# EAGLE design mega8 Control Board (EAGLE 5.07)
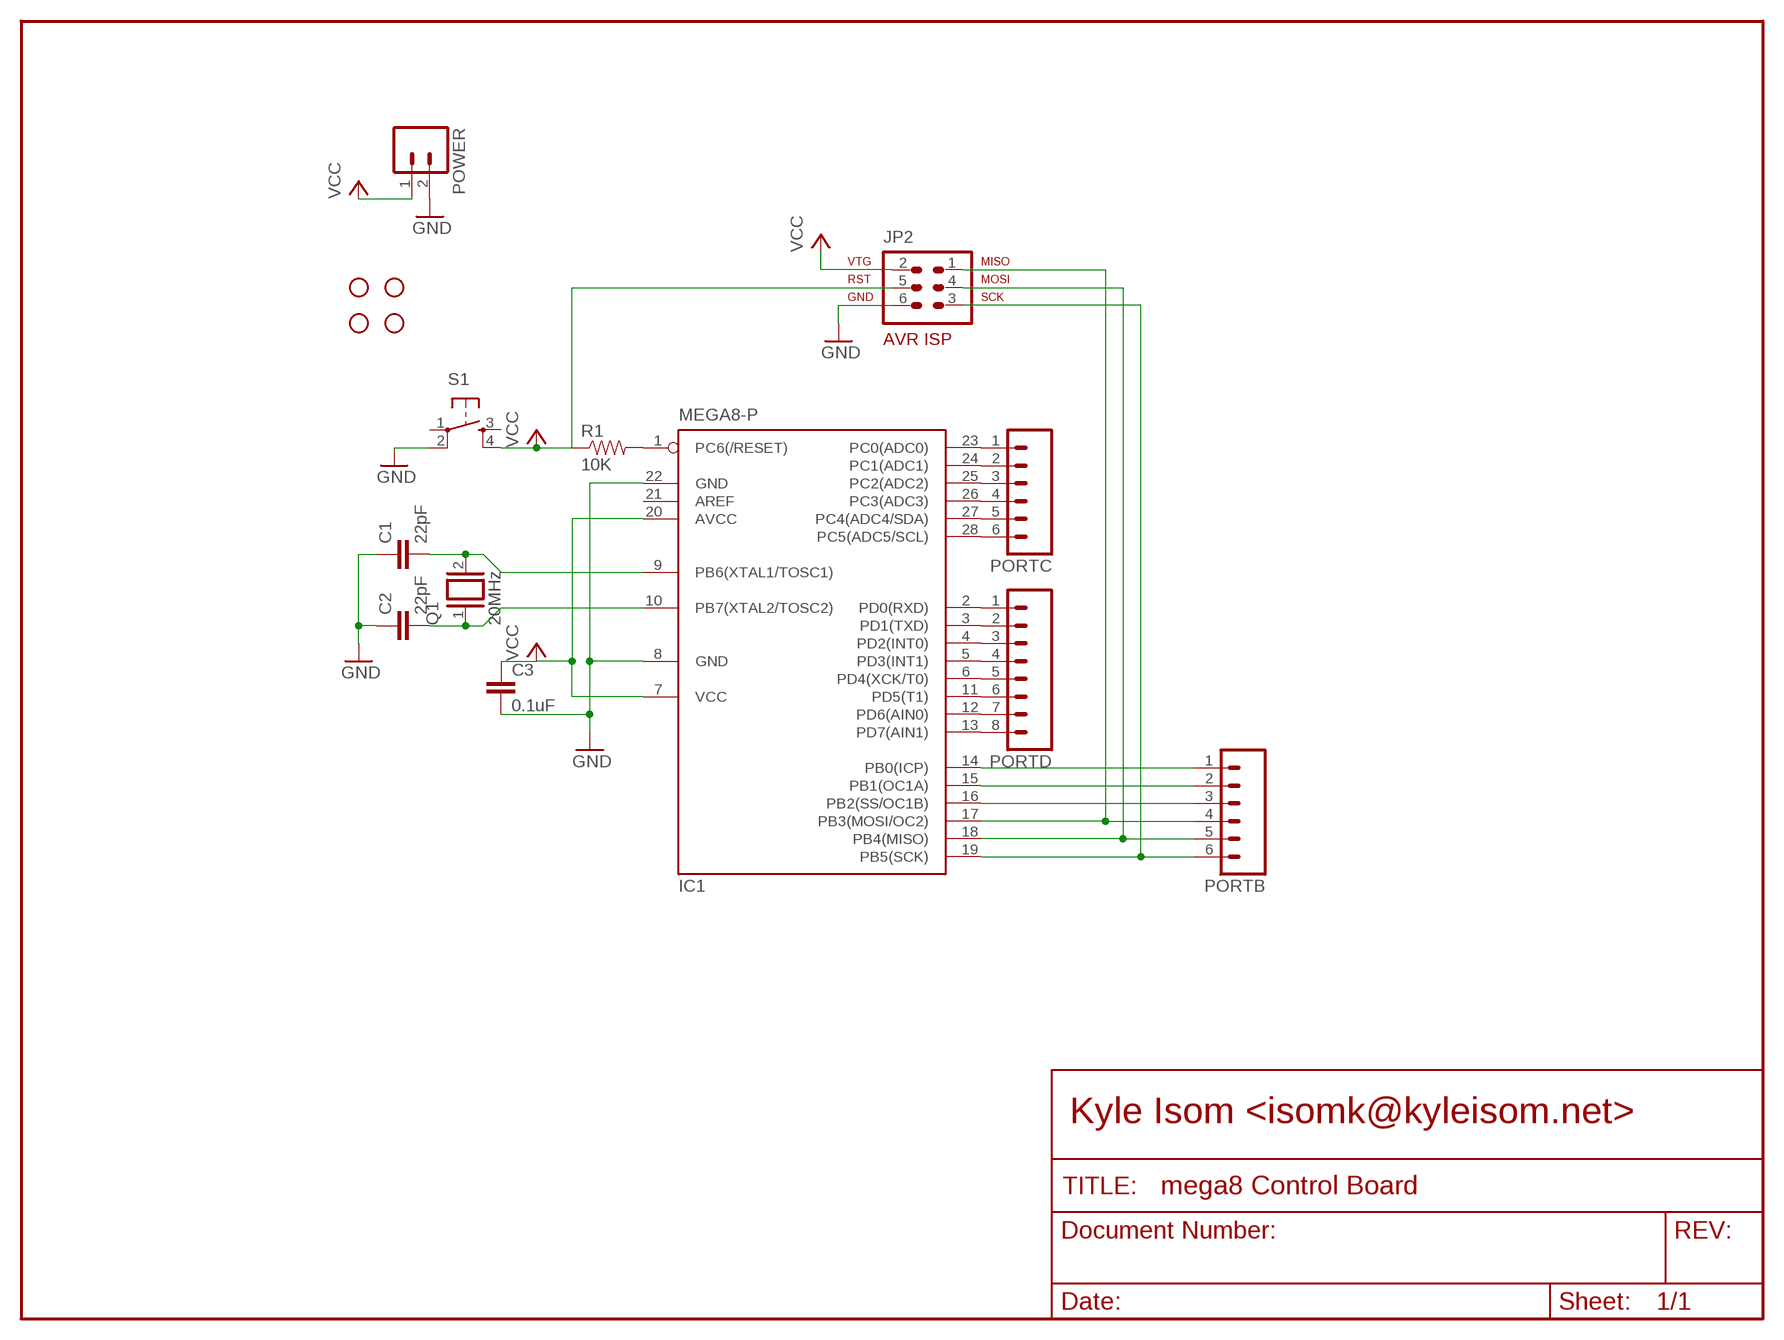
[diagram p0: schematic, sheet 1]

## Parts
C1  22pF  CAPPTH1  [CAP-PTH-5MM]
C2  22pF  CAPPTH1  [CAP-PTH-5MM]
C3  0.1uF  CAPPTH1  [CAP-PTH-5MM]
IC1  MEGA8-P  [DIL28-3]
JP1  STAND-OFF  [STAND-OFF]
JP2  AVR-ISP-6  [AVR-ISP-6]
JP3  STAND-OFF  [STAND-OFF]
JP4  STAND-OFF  [STAND-OFF]
JP5  STAND-OFF  [STAND-OFF]
PORTB  M06LOCK  [1X06_LOCK]
PORTC  M06LOCK  [1X06_LOCK]
PORTD  M08LOCK  [1X08_LOCK]
POWER  M02LOCK  [1X02_LOCK]
Q1  20MHz  XTAL/S  [QS]
R1  10K  RESISTORPTH1  [AXIAL-0.3]
S1  TAC_SWITCHPTH  [TACTILE-PTH]

## Nets
GND: C1.1 C2.1 C3.2 IC1.8(GND) IC1.22(GND) JP2.6 POWER.2 S1.2
N$1: IC1.1(PC6(/RESET)) R1.P$2
N$3: C1.2 IC1.9(PB6(XTAL1/TOSC1)) Q1.2
N$4: C2.2 IC1.10(PB7(XTAL2/TOSC2)) Q1.1
N$6: IC1.19(PB5(SCK)) JP2.3 PORTB.6
N$7: IC1.18(PB4(MISO)) JP2.4 PORTB.5
N$8: IC1.17(PB3(MOSI/OC2)) JP2.1 PORTB.4
N$9: IC1.23(PC0(ADC0)) PORTC.1
N$10: IC1.24(PC1(ADC1)) PORTC.2
N$11: IC1.25(PC2(ADC2)) PORTC.3
N$12: IC1.26(PC3(ADC3)) PORTC.4
N$13: IC1.27(PC4(ADC4/SDA)) PORTC.5
N$14: IC1.28(PC5(ADC5/SCL)) PORTC.6
N$15: IC1.2(PD0(RXD)) PORTD.1
N$16: IC1.3(PD1(TXD)) PORTD.2
N$17: IC1.4(PD2(INT0)) PORTD.3
N$18: IC1.5(PD3(INT1)) PORTD.4
N$19: IC1.6(PD4(XCK/T0)) PORTD.5
N$20: IC1.11(PD5(T1)) PORTD.6
N$21: IC1.12(PD6(AIN0)) PORTD.7
N$22: IC1.13(PD7(AIN1)) PORTD.8
N$23: IC1.14(PB0(ICP)) PORTB.1
N$24: IC1.15(PB1(OC1A)) PORTB.2
N$25: IC1.16(PB2(SS/OC1B)) PORTB.3
VCC: C3.1 IC1.7(VCC) IC1.20(AVCC) JP2.2 JP2.5 POWER.1 R1.P$1 S1.4
Unconnected: IC1.21(AREF) S1.1 S1.3

## Notes on the sheet
- Kyle Isom <isomk@kyleisom.net>

## Library data of the parts
C1-C3 = SparkFun:CAP: Capacitor Standard 0603 ceramic capacitor, and 0.1" leaded capacitor.
IC1 = atmel:MEGA8-P: MICROCONTROLLER 8 Kbytes FLASH, 1 kbytes SRAM, 512 bytes EEPROM, USART, 4-channel 10 bit ADC, 2-channel 8 bit ADC Pin compatible with Atmega48, ATMega88, ATMega168 Source: avr.lbr
JP1 JP3-JP5 = SparkFun:STAND-OFF: Stand Off This is the mechanical footprint for a #4 phillips button head screw. Use the keepout ring to avoid running the screw head into surrounding components. SKU : PRT-00447
JP2 = avr-6:AVR-ISP-6: AVR ISP-6 Serial Programming Header
PORTB PORTC = SparkFun:M06: Header 6 Standard 6-pin 0.1" header. Use with straight break away headers (SKU : PRT-00116), right angle break away headers (PRT-00553), swiss pins (PRT-00743), machine pins (PRT-00117), and female headers (PRT-00115). Molex polarized connector foot print use with SKU : PRT-08094 with associated crimp pins and housings. NOTES ON THE VARIANTS LOCK and LOCK_LONGPADS... This footprint was designed to help hold the alignment of a through-hole component (i.e. 6-pin header) while soldering it into place. You may notice that each hole has been shifted either up or down by 0.005 of an inch from it's more standard position (which is a perfectly straight line). This slight alteration caused the pins (the squares in the middle) to touch the edges of the holes. Because they are alternating, it causes a "brace" to hold the component in place. 0.005 has proven to be the perfect amount of "off-center" position when using our standard breakaway headers. Although looks a little odd when you look at the bare footprint, once you have a header in there, the alteration is very hard to notice. Also, if you push a header all the way into place, it is covered up entirely on the bottom side. This idea of altering the position of holes to aid alignment will be further integrated into the Sparkfun Library for other footprints. It can help hold any component with 3 or more connection pins.
PORTD = SparkFun:M08: Header 8 Standard 8-pin 0.1" header. Use with straight break away headers (SKU : PRT-00116), right angle break away headers (PRT-00553), swiss pins (PRT-00743), machine pins (PRT-00117), and female headers (PRT-00115).
POWER = SparkFun:M02: Header 2 Standard 2-pin 0.1" header. Use with straight break away headers (SKU : PRT-00116), right angle break away headers (PRT-00553), swiss pins (PRT-00743), machine pins (PRT-00117), and female headers (PRT-00115). Molex polarized connector foot print use with SKU : PRT-08233 with associated crimp pins and housings.
Q1 = special:XTAL/S: CRYSTAL
R1 = SparkFun:RESISTOR: Resistor Basic schematic elements and footprints for 0603, 1206, and PTH 1/10th watt (small) resistors.
S1 = SparkFun:TAC_SWITCH: Momentary Switch Button commonly used for reset or general input. Spark Fun Electronics SKU : COM-00097

## Board
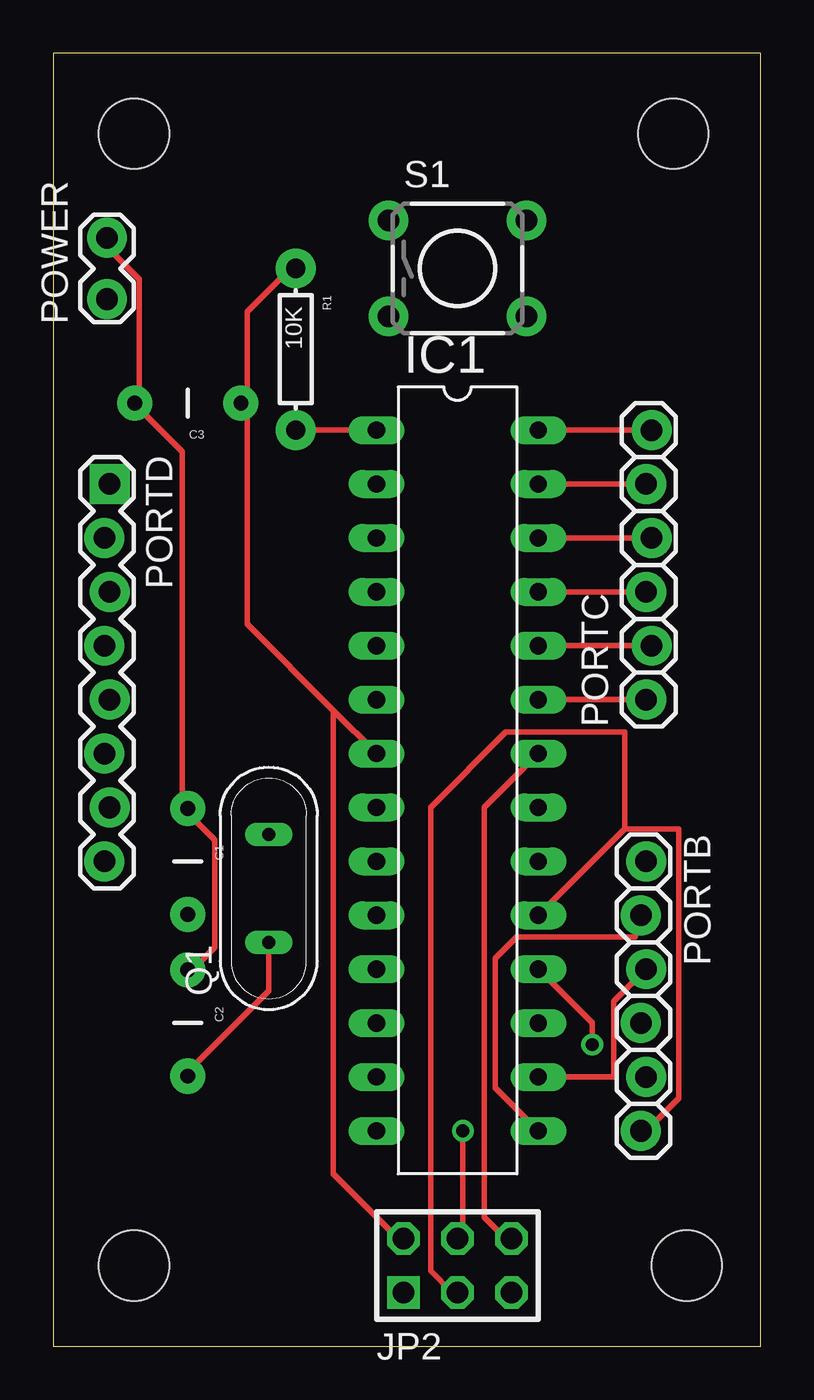
[diagram p1: board, top side]
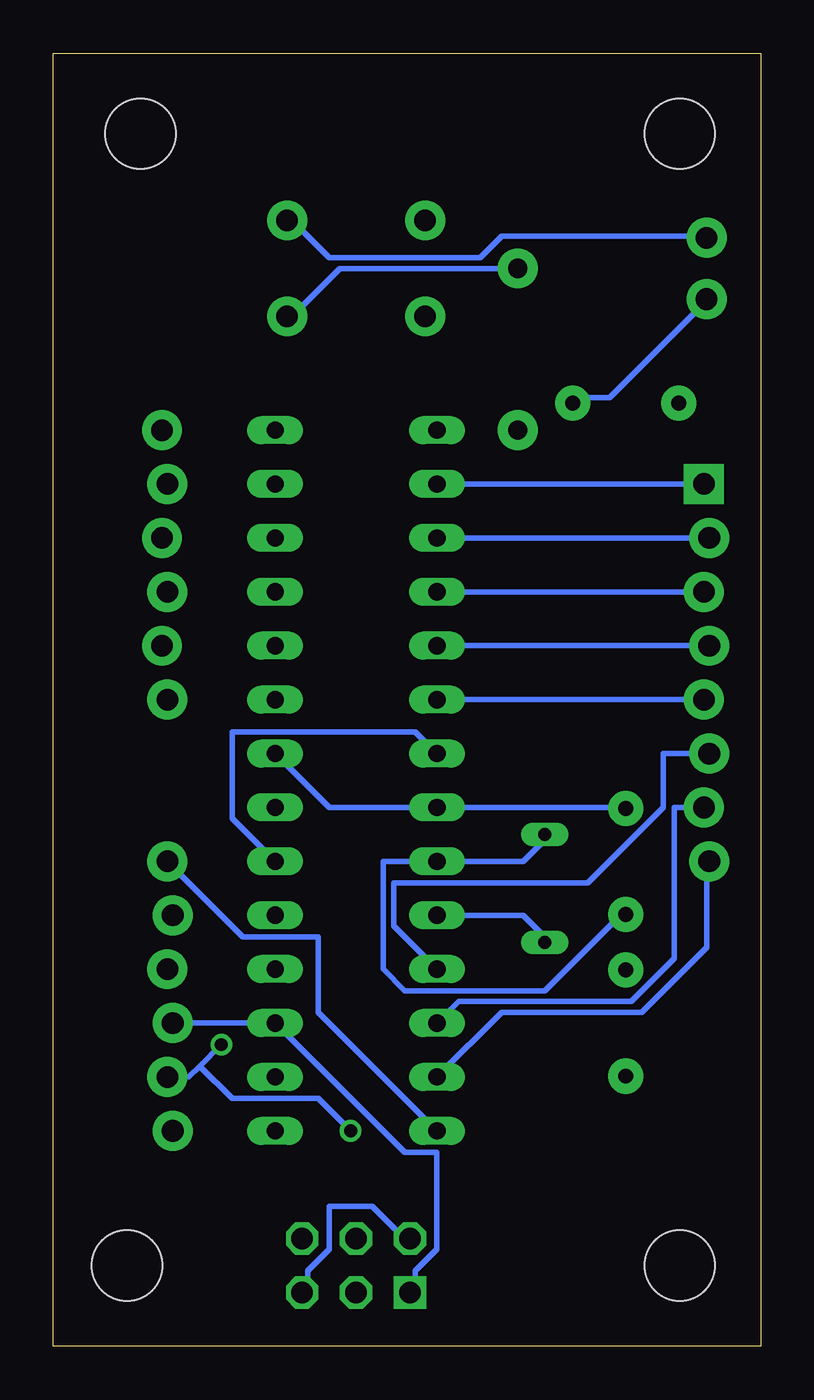
[diagram p2: board, bottom side, seen from below]

Size 33.33 x 60.95 mm. Coordinates in mm from the lower left corner, seen from the top.
Outline: 0,0 33.33,0 33.33,60.95 0,60.95 0,0
Copper layers (1*16): Top 0.035mm / dielectric 1.5mm / Bottom 0.035mm
Design rules "default": minimum track width 10mil, minimum drill 24mil, track to track 8mil, track to pad 8mil, pad to pad 8mil, via to via 8mil, smd to smd 8mil, copper to edge 40mil, drill to drill 8mil, minimum pad ring 10mil, minimum via ring 8mil, stop-mask expansion 4mil, vias tented up to drill 0mil, thermal gap 10mil

### Footprints (pad centres in the part's own frame; a part is rotated, then mirrored left to right if it is on the bottom)
CAP-PTH-5MM = drill 0.7 pad 1.651 round: 1 -2.5,0; 2 2.5,0
DIL28-3 = drill 0.813 long: 1 -16.51,-3.81; 2 -13.97,-3.81; 3 -11.43,-3.81; 4 -8.89,-3.81; 5 -6.35,-3.81; 6 -3.81,-3.81; 7 -1.27,-3.81; 8 1.27,-3.81; 9 3.81,-3.81; 10 6.35,-3.81; 11 8.89,-3.81; 12 11.43,-3.81; 13 13.97,-3.81; 14 16.51,-3.81; 15 16.51,3.81; 16 13.97,3.81; 17 11.43,3.81; 18 8.89,3.81; 19 6.35,3.81; 20 3.81,3.81; 21 1.27,3.81; 22 -1.27,3.81; 23 -3.81,3.81; 24 -6.35,3.81; 25 -8.89,3.81; 26 -11.43,3.81; 27 -13.97,3.81; 28 -16.51,3.81
STAND-OFF = hole 3.302: 0,0
AVR-ISP-6 = drill 1.016 square: 1 -2.54,-1.27 | drill 1.016 octagon: 2 -2.54,1.27; 3 0,-1.27; 4 0,1.27; 5 2.54,-1.27; 6 2.54,1.27
1X06_LOCK = drill 1.016 pad 1.88 round: 1 0,0; 2 2.54,-0.254; 3 5.08,0; 4 7.62,-0.254; 5 10.16,0; 6 12.7,-0.254
1X08_LOCK = drill 1.016 pad 1.88 square: 1 0,0.127 | drill 1.016 pad 1.88 round: 2 2.54,-0.127; 3 5.08,0.127; 4 7.62,-0.127; 5 10.16,0.127; 6 12.7,-0.127; 7 15.24,0.127; 8 17.78,-0.127
1X02_LOCK = drill 1.016 pad 1.88 round: 1 -0.178,0; 2 2.718,0
QS = drill 0.61 long: 1 -2.54,0; 2 2.54,0
AXIAL-0.3 = drill 0.9 pad 1.88 round: P$1 -3.81,0; P$2 3.81,0
TACTILE-PTH = drill 1.016 pad 1.88 round: 1 -3.251,2.261; 2 3.251,2.261; 3 -3.251,-2.261; 4 3.251,-2.261

### Placement (x,y rotation side)
C1  6.35,22.86 270 top
C2  6.35,15.24 270 top
C3  6.35,44.45 180 top
IC1  19.05,26.67 270 top
JP1  3.81,3.81 0 top
JP2  19.05,3.81 0 top
JP3  29.84,3.81 0 top
JP4  29.21,57.15 0 top
JP5  3.81,57.15 0 top
PORTB  27.94,22.86 270 top
PORTC  27.94,30.48 90 top
PORTD  2.54,40.64 270 top
POWER  2.54,49.53 90 top
Q1  10.16,21.59 90 top
R1  11.43,46.99 270 top
S1  19.05,50.8 0 top

### Tracks (layer width: path | path; a pad name or v marks a point on that pad's centre or on a via)
GND
  Top 0.254: POWER.2 2.54,51.82 4.06,50.29 4.06,44.7 C3.2 4.06,44.2 6.1,42.16 6.1,25.4 C1.1 6.6,24.89 7.62,23.88 7.62,18.8 6.6,17.78 C2.1 | IC1.22 20.32,25.4 20.32,6.1 21.34,5.08 JP2.6
  Bottom 0.254: S1.2 21.84,52.83 20.32,51.31 13.21,51.31 12.19,52.32 2.54,52.32 POWER.2 | C1.1 6.6,25.4 IC1.8 20.32,25.4 IC1.22
N$1
  Top 0.254: R1.P$2 IC1.1
N$3
  Bottom 0.254: Q1.2 10.16,23.88 11.18,22.86 IC1.9 17.78,22.86 17.78,17.78 16.76,16.76 10.16,16.76 6.6,20.32 C1.2
N$4
  Top 0.254: C2.2 6.6,13.21 10.16,16.76 Q1.1
  Bottom 0.254: IC1.10 11.18,20.32 10.16,19.3 Q1.1
N$6
  Top 0.254: 26.92,24.38 IC1.19 | 26.92,24.38 29.46,24.38 29.46,11.68 27.94,10.16 PORTB.6 | 26.92,24.38 26.92,28.96 21.34,28.96 17.78,25.4 17.78,3.56 18.8,2.54 JP2.3
N$7  (via drill 0.61)
  Top 0.254: IC1.18 25.4,15.24 v25.4,14.22 | v19.3,10.16 19.3,5.08 JP2.4
  Bottom 0.254: 26.42,13.21 26.92,12.7 PORTB.5 | 26.42,13.21 v25.4,14.22 | v19.3,10.16 20.83,11.68 24.89,11.68 26.42,13.21
N$8
  Bottom 0.254: PORTB.4 IC1.17 16.76,9.14 15.24,9.14 15.24,4.57 16.26,3.56 16.26,2.54 JP2.1
N$9
  Top 0.254: IC1.23 PORTC.1
N$10
  Top 0.254: IC1.24 PORTC.2
N$11
  Top 0.254: IC1.25 PORTC.3
N$12
  Top 0.254: IC1.26 PORTC.4
N$13
  Top 0.254: IC1.27 PORTC.5
N$14
  Top 0.254: IC1.28 PORTC.6
N$15
  Bottom 0.254: PORTD.1 IC1.2
N$16
  Bottom 0.254: PORTD.2 IC1.3
N$17
  Bottom 0.254: PORTD.3 IC1.4
N$18
  Bottom 0.254: PORTD.4 IC1.5
N$19
  Bottom 0.254: PORTD.5 IC1.6
N$20
  Bottom 0.254: IC1.11 17.27,19.81 17.27,21.84 8.13,21.84 4.57,25.4 4.57,27.94 PORTD.6
N$21
  Bottom 0.254: IC1.12 14.22,16.26 6.1,16.26 4.06,18.29 4.06,25.4 PORTD.7
N$22
  Bottom 0.254: IC1.13 12.19,15.75 5.59,15.75 2.54,18.8 2.54,22.86 PORTD.8
N$23
  Bottom 0.254: IC1.14 20.83,15.75 20.83,19.3 24.38,19.3 PORTB.1
N$24
  Top 0.254: IC1.15 20.83,12.19 20.83,18.29 21.84,19.3 27.43,19.3 27.43,20.32 PORTB.2
N$25
  Top 0.254: IC1.16 26.42,12.7 26.42,16.26 PORTB.3
VCC
  Top 0.254: 13.21,29.97 9.14,34.04 9.14,44.2 C3.1 9.14,44.7 9.14,48.77 11.18,50.8 R1.P$1 | 13.21,29.97 IC1.7 | 13.21,29.97 13.21,8.13 16.26,5.08 JP2.2
  Bottom 0.254: JP2.5 21.34,2.54 21.34,3.56 20.32,4.57 20.32,6.6 18.29,6.6 16.76,5.08 JP2.2 | IC1.20 24.89,24.89 24.89,28.96 16.26,28.96 IC1.7 | POWER.1 2.54,49.28 7.11,44.7 8.64,44.7 C3.1 | S1.4 21.84,48.77 19.81,50.8 R1.P$1